# Altium schematic sheet ProbadorDeCables_Accesorios_B_Interlock.SchDoc
size A4
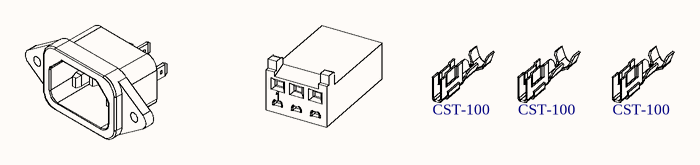
[diagram p0: ProbadorDeCables_Accesorios_B_Interlock.SchDoc]

## Parts
BOM_B50  Interlock macho para gabinete  [BOM_703W-00/04]  (value not drawn)  (mechanical)
BOM_B50__1  CST-100-3  [BOM_CST-100-3]  (value not drawn)  (mechanical)
BOM_B50__2  ParaHousing: CST-100  [BOM_sock_CST_1375819-1]  (hidden comment: sock_CST_1375819-1)  (mechanical)
BOM_B50__3  ParaHousing: CST-100  [BOM_sock_CST_1375819-1]  (hidden comment: sock_CST_1375819-1)  (mechanical)
BOM_B50__4  ParaHousing: CST-100  [BOM_sock_CST_1375819-1]  (hidden comment: sock_CST_1375819-1)  (mechanical)

## Library data of the parts
BOM_B50 = Interlock macho para gabinete: PWR ENT RCPT IEC320-C14 PANEL QC; Cod.Fabricante: 703W-00/04; Fabricante: Qualtek; Cod.DigiKey: Q212-ND; ComponentLink1Description: Manufacturer Link; ComponentLink1URL: http://www.qualtekusa.com/images/AC_Receptacles/pdfs/703w0004.pdf; DIGIKEYx50: 0.65460; DIGIKEYx100: 0.62610
BOM_B50__1 = CST-100-3: CONN RCPT HSNG 3POS CST-100 II; Cod.Fabricante: 1375820-3; Fabricante: TE Connectivity AMP Connectors; Cod.DigiKey: A99614-ND; ComponentLink1Description: Manufacturer Link; ComponentLink1URL: https://www.te.com/commerce/DocumentDelivery/DDEController?Action=srchrtrv&DocNm=1375820&DocType=Customer+Drawing&DocLang=English; DIGIKEYx50: 0.12620; DIGIKEYx100: 0.11720
BOM_B50__2-BOM_B50__4 = sock_CST_1375819-1: CONN SOCKET 22-26AWG CRIMP TIN; Fabricante: TE Connectivity AMP Connectors; Cod.DigiKey: A100453CT-ND; Cod.Fabricante: 1375819-1; ComponentLink1Description: Manufacturer Link; ComponentLink1URL: https://www.te.com/commerce/DocumentDelivery/DDEController?Action=srchrtrv&DocNm=1375819&DocType=Customer+Drawing&DocLang=English; DIGIKEYx100: 0.04210; DIGIKEYx50: 0.03960